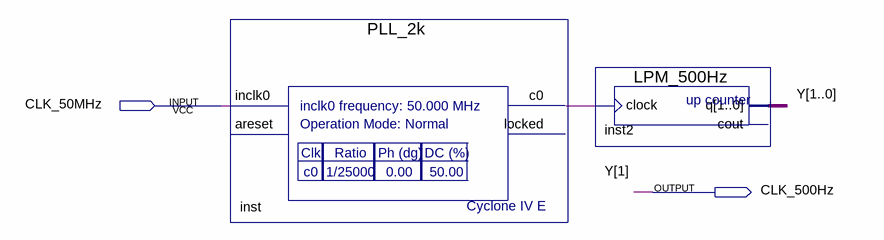
[diagram p0: schematic sheet]
// Quartus schematic clocksignal.bdf as structural Verilog: 2 symbols, 2 pins
module clocksignal (
  input  CLK_50MHz,
  output CLK_500Hz
);

  wire inst_c0;
  wire [0:0] Y;

  PLL_2k inst (.inclk0(CLK_50MHz), .c0(inst_c0));  // open: areset, locked
  LPM_500Hz inst2 (.clock(inst_c0), .q({CLK_500Hz, Y[0]}));  // open: cout

  // Other names for the same wires on the sheet: Y[1] = CLK_500Hz
endmodule
